# EAGLE design AgitPOV_WiFi (EAGLE 7.4.0)
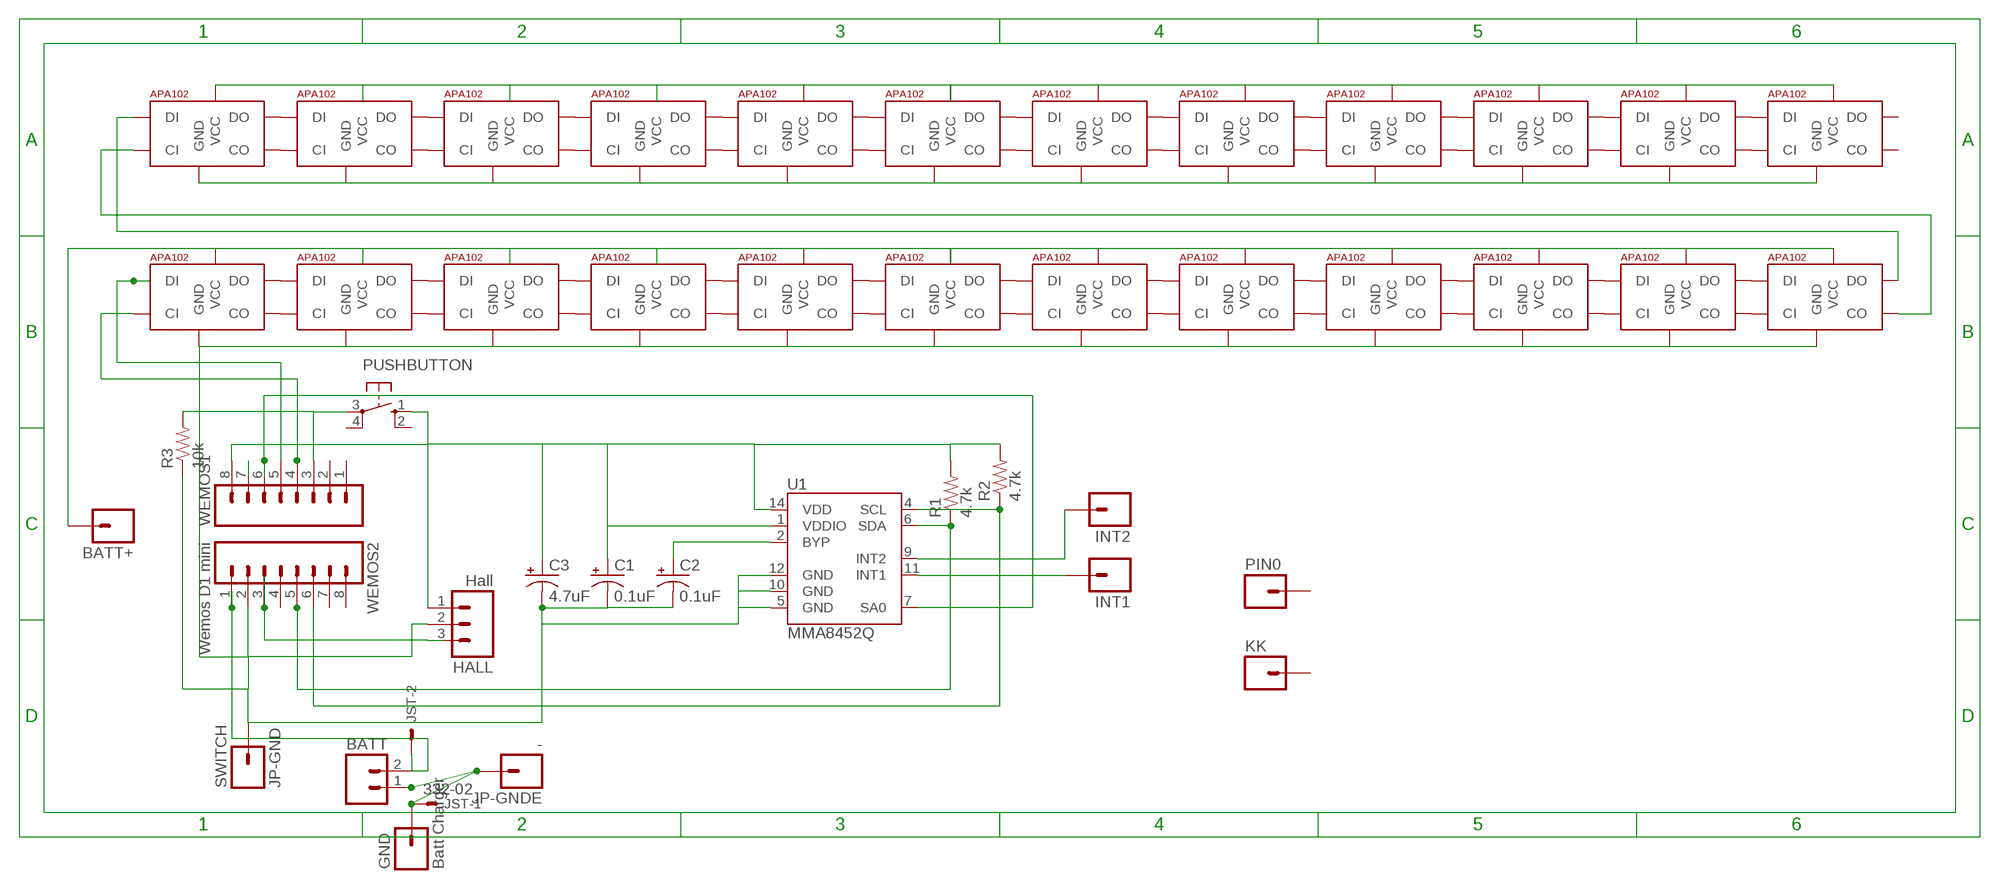
[diagram p0: schematic, sheet 1]

## Parts
BATT  M02LOCK_LONGPADS  [1X02_LOCK_LONGPADS]
BATT+  M01PTH  [1X01]
C1  0.1uF  10UF-16V-10%(TANT)  [EIA3216]
C2  0.1uF  10UF-16V-10%(TANT)  [EIA3216]
C3  4.7uF  10UF-16V-10%(TANT)  [EIA3216]
DEL1  APA1025050  [APA102_5050]
DEL2  APA1025050  [APA102_5050]
DEL3  APA1025050  [APA102_5050]
DEL4  APA1025050  [APA102_5050]
DEL5  APA1025050  [APA102_5050]
DEL6  APA1025050  [APA102_5050]
DEL7  APA1025050  [APA102_5050]
DEL8  APA1025050  [APA102_5050]
DEL9  APA1025050  [APA102_5050]
DEL10  APA1025050  [APA102_5050]
DEL11  APA1025050  [APA102_5050]
DEL12  APA1025050  [APA102_5050]
DEL13  APA1025050  [APA102_5050]
DEL15  APA1025050  [APA102_5050]
DEL16  APA1025050  [APA102_5050]
DEL17  APA1025050  [APA102_5050]
DEL18  APA1025050  [APA102_5050]
DEL19  APA1025050  [APA102_5050]
DEL20  APA1025050  [APA102_5050]
DEL21  APA1025050  [APA102_5050]
DEL22  APA1025050  [APA102_5050]
DEL23  APA1025050  [APA102_5050]
DEL24  APA1025050  [APA102_5050]
FFFFF  APA1025050  [APA102_5050]
GND  Batt Charger  M01PTH  [1X01]
HALL  Hall  M03PTH  [1X03]
INT1  M01PTH  [1X01]
INT2  M01PTH  [1X01]
JP-GND  SWITCH  M01PTH  [1X01]
JP-GNDE  -  M01PTH  [1X01]
JST  332-02  [332-02]
KK  M01PTH  [1X01]
PIN0  M01PTH  [1X01]
PUSHBUTTON  10-XX  [B3F-10XX]
R1  4.7k  RESISTOR1206  [1206]
R2  4.7k  RESISTOR1206  [1206]
R3  10k  RESISTOR1206  [1206]
U1  MMA8452Q  [QFN-16_0.5MM]
WEMOS1  M08  [1X08_ROUND]
WEMOS2  Wemos D1 mini  M08  [1X08_ROUND]

## Nets
5V: BATT+.1 BATT.2 DEL1.1(VCC) DEL2.1(VCC) DEL3.1(VCC) DEL4.1(VCC) DEL5.1(VCC) DEL6.1(VCC) DEL7.1(VCC) DEL8.1(VCC) DEL9.1(VCC) DEL10.1(VCC) DEL11.1(VCC) DEL12.1(VCC) DEL13.1(VCC) DEL15.1(VCC) DEL16.1(VCC) DEL17.1(VCC) DEL18.1(VCC) DEL19.1(VCC) DEL20.1(VCC) DEL21.1(VCC) DEL22.1(VCC) DEL23.1(VCC) DEL24.1(VCC) FFFFF.1(VCC) JST.2 WEMOS2.1
+3.3V: C1.A(+) C3.A(+) HALL.1 PUSHBUTTON.1(S) R1.2 R2.2 U1.1(VDDIO) U1.14(VDD) WEMOS1.8
BYP: C2.A(+) U1.2(BYP)
ENTREEGND: BATT.1 GND.1 JP-GNDE.1 JST.1
GND: C1.C(-) C2.C(-) C3.C(-) DEL1.6(GND) DEL2.6(GND) DEL3.6(GND) DEL4.6(GND) DEL5.6(GND) DEL6.6(GND) DEL7.6(GND) DEL8.6(GND) DEL9.6(GND) DEL10.6(GND) DEL11.6(GND) DEL12.6(GND) DEL13.6(GND) DEL15.6(GND) DEL16.6(GND) DEL17.6(GND) DEL18.6(GND) DEL19.6(GND) DEL20.6(GND) DEL21.6(GND) DEL22.6(GND) DEL23.6(GND) DEL24.6(GND) FFFFF.6(GND) HALL.2 JP-GND.1 R3.1 U1.5(GND) U1.10(GND) U1.12(GND) WEMOS2.2
N$1: WEMOS1.7
N$2: DEL1.5(CI) WEMOS1.4
N$4: DEL1.4(DI) WEMOS1.5
N$8: DEL12.2(CO) DEL13.5(CI)
N$12: DEL2.2(CO) DEL3.5(CI)
N$14: DEL2.3(DO) DEL3.4(DI)
N$15: DEL1.3(DO) DEL2.4(DI)
N$16: DEL1.2(CO) DEL2.5(CI)
N$17: DEL3.3(DO) DEL4.4(DI)
N$18: DEL3.2(CO) DEL4.5(CI)
N$19: DEL4.3(DO) DEL5.4(DI)
N$20: DEL4.2(CO) DEL5.5(CI)
N$21: DEL5.3(DO) DEL6.4(DI)
N$22: DEL5.2(CO) DEL6.5(CI)
N$23: DEL6.3(DO) DEL7.4(DI)
N$24: DEL6.2(CO) DEL7.5(CI)
N$25: DEL7.3(DO) DEL8.4(DI)
N$26: DEL7.2(CO) DEL8.5(CI)
N$27: DEL8.3(DO) DEL9.4(DI)
N$28: DEL8.2(CO) DEL9.5(CI)
N$29: DEL9.3(DO) DEL10.4(DI)
N$30: DEL9.2(CO) DEL10.5(CI)
N$31: DEL10.3(DO) DEL11.4(DI)
N$32: DEL10.2(CO) DEL11.5(CI)
N$33: DEL11.3(DO) DEL12.4(DI)
N$34: DEL11.2(CO) DEL12.5(CI)
N$41: HALL.3 WEMOS2.3
N$42: DEL12.3(DO) DEL13.4(DI)
N$43: DEL15.5(CI) FFFFF.2(CO)
N$44: DEL15.4(DI) FFFFF.3(DO)
N$45: DEL13.3(DO) FFFFF.4(DI)
N$46: DEL13.2(CO) FFFFF.5(CI)
N$47: DEL15.3(DO) DEL16.4(DI)
N$48: DEL15.2(CO) DEL16.5(CI)
N$49: DEL16.3(DO) DEL17.4(DI)
N$50: DEL16.2(CO) DEL17.5(CI)
N$51: DEL17.3(DO) DEL18.4(DI)
N$52: DEL17.2(CO) DEL18.5(CI)
N$53: DEL18.3(DO) DEL19.4(DI)
N$54: DEL18.2(CO) DEL19.5(CI)
N$55: DEL19.3(DO) DEL20.4(DI)
N$56: DEL19.2(CO) DEL20.5(CI)
N$57: DEL20.3(DO) DEL21.4(DI)
N$58: DEL20.2(CO) DEL21.5(CI)
N$59: DEL21.3(DO) DEL22.4(DI)
N$60: DEL21.2(CO) DEL22.5(CI)
N$61: DEL22.3(DO) DEL23.4(DI)
N$62: DEL22.2(CO) DEL23.5(CI)
N$63: DEL23.3(DO) DEL24.4(DI)
N$64: DEL23.2(CO) DEL24.5(CI)
N$65: INT1.1 U1.11(INT1)
N$67: INT2.1 U1.9(INT2)
PULLDOWN: PUSHBUTTON.3(P) R3.2 WEMOS1.3
SA0: U1.7(SA0) WEMOS1.6
SCL: R2.1 U1.4(SCL) WEMOS2.6
SDA: R1.1 U1.6(SDA) WEMOS2.5
Unconnected: DEL24.2(CO) DEL24.3(DO) KK.1 PIN0.1 PUSHBUTTON.2(S1) PUSHBUTTON.4(P1) WEMOS1.1 WEMOS1.2 WEMOS2.4 WEMOS2.7 WEMOS2.8

## Library data of the parts
BATT = SparkFun-Connectors:M02: Standard 2-pin 0.1" header. Use with - straight break away headers ( PRT-00116) - right angle break away headers (PRT-00553) - swiss pins (PRT-00743) - machine pins (PRT-00117) - female headers (PRT-00115) Molex polarized connector foot print use with: PRT-08233 with associated crimp pins and housings. 2.54_SCREWTERM for use with PRT-10571. 3.5mm Screw Terminal footprints for PRT-08084 5mm Screw Terminal footprints for use with PRT-08432
BATT+ GND INT1 INT2 JP-GND JP-GNDE KK PIN0 = SparkFun-Connectors:M01: Header 1 Standard 1-pin 0.1" header. Use with straight break away headers (SKU : PRT-00116), right angle break away headers (PRT-00553), swiss pins (PRT-00743), machine pins (PRT-00117), and female headers (PRT-00115).
C1-C3 = SparkFun-Capacitors:10UF-16V-10%(TANT): CAP-00811 1206/EIA-3216 Tantalum capacitor; PROD_ID: CAP-00811; VALUE: 10uF
DEL1-DEL13 DEL15-DEL24 FFFFF = jos-ph:APA102: APA102C 5050 RGB LED -- Adafruit DotStar Single LED Pixel Product Page: https://www.adafruit.com/products/2343 Datasheet: https://cdn-shop.adafruit.com/product-files/2343/APA102C.pdf
HALL = SparkFun-Connectors:M03: Header 3 Standard 3-pin 0.1" header. Use with straight break away headers (SKU : PRT-00116), right angle break away headers (PRT-00553), swiss pins (PRT-00743), machine pins (PRT-00117), and female headers (PRT-00115). Molex polarized connector foot print use with SKU : PRT-08232 with associated crimp pins and housings.
JST = con-garry:332-02: 2 Pin - 2mm Dual Row Source: www.mpe-connector.de / garry_shortform_2012.pdf
PUSHBUTTON = switch-omron:10-XX: OMRON SWITCH; MPN: B3F-1000; OC_FARNELL: 176432; OC_NEWARK: 36M3542
R1-R3 = SparkFun-Resistors:RESISTOR: Resistor Basic schematic elements and footprints for 0603, 1206, and PTH resistors.
U1 = SparkFun-Sensors:MMA8452Q: MMA8452Q 3-Axis, 12/8-bit Digital Accelerometer Supply Voltage: 1.6-3.6V Range: +/- 2g, 4g, 8g Interface: I2C, 12-bit and 8-bit ODR: 1.56 Hz - 800 Hz Package: QFN-16 http://cache.freescale.com/files/sensors/doc/data_sheet/MMA8452Q.pdf; PROD_ID: IC-10769
WEMOS1 WEMOS2 = SparkFun-Connectors:M08: Header 8 Standard 8-pin 0.1" header. Use with straight break away headers (SKU : PRT-00116), right angle break away headers (PRT-00553), swiss pins (PRT-00743), machine pins (PRT-00117), and female headers (PRT-00115).

## Board
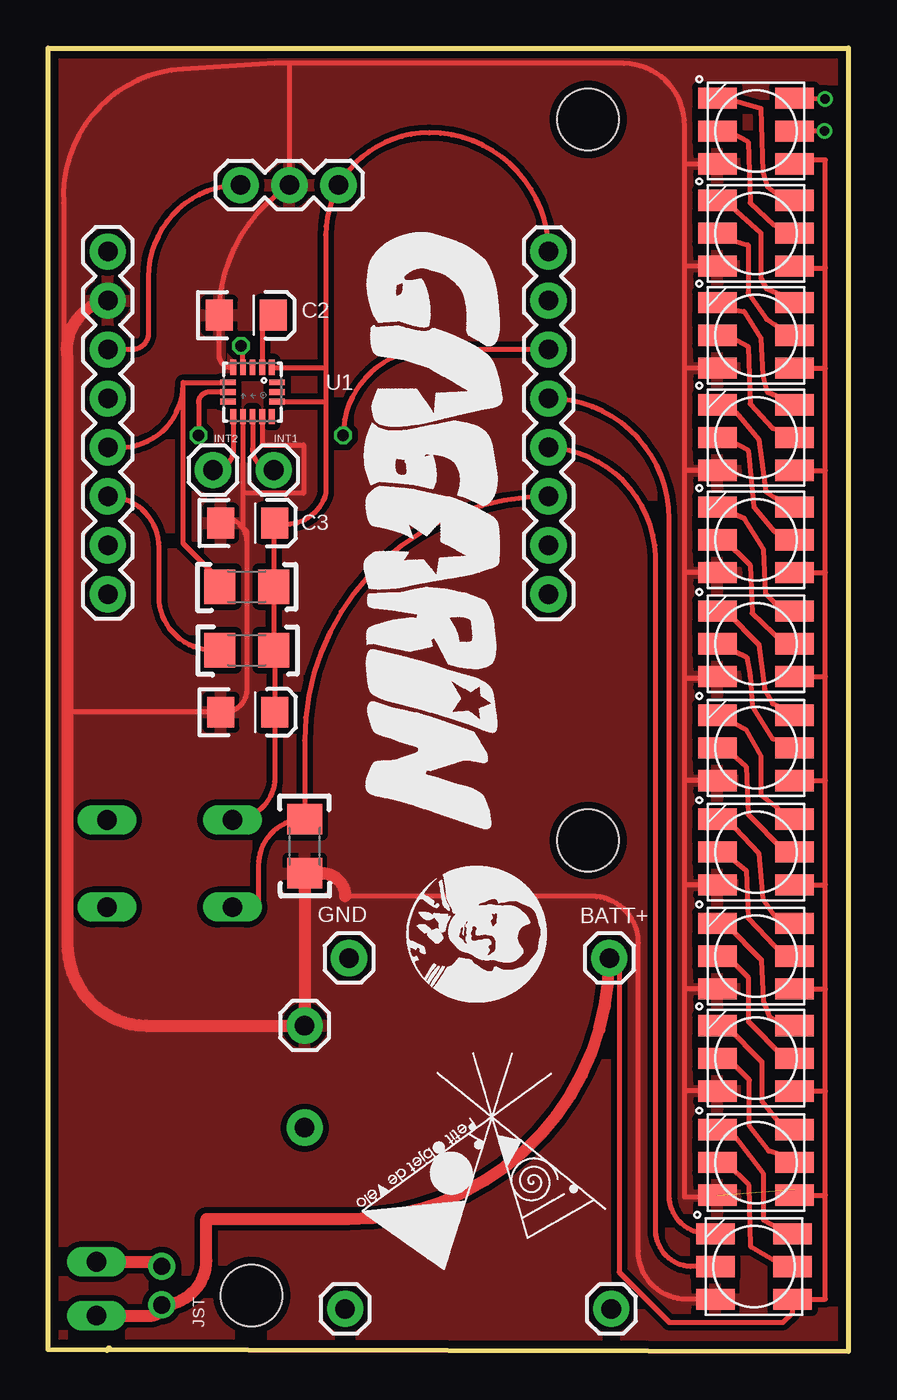
[diagram p1: board, top side]
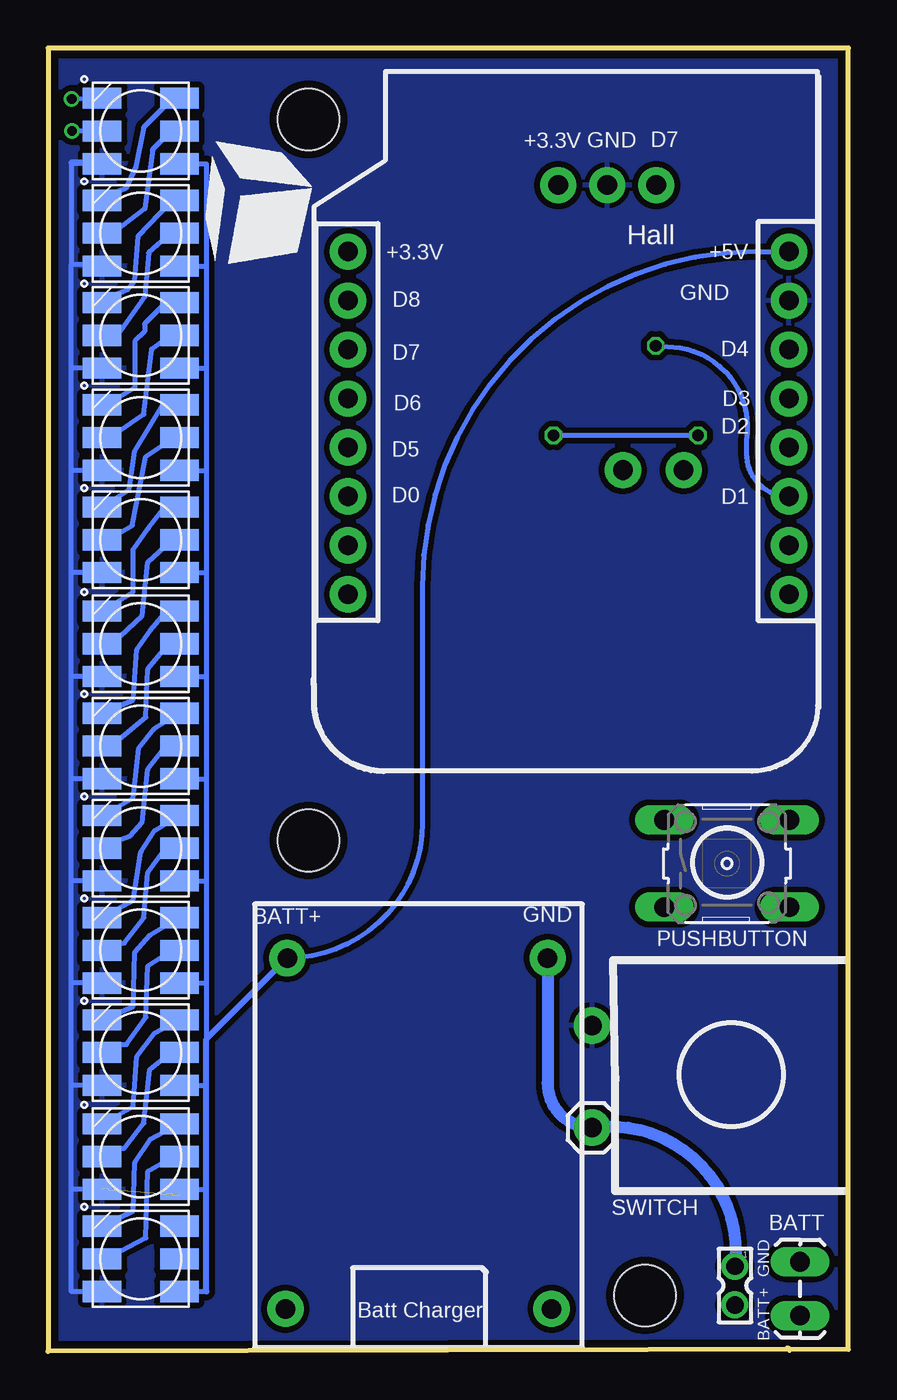
[diagram p2: board, bottom side, seen from below]

Size 41.5 x 67.6 mm. Coordinates in mm from the lower left corner, seen from the top.
Outline: 3.05,0.03 arc-90 3.19,0.17
Outline: 0,0.1 0,67.6 41.5,67.6 41.5,0 0,0.1
Copper layers (1*16): Top 0.035mm / dielectric 1.5mm / Bottom 0.035mm
Design rules "NOA Eagle Rule 2016-06-12": minimum track width 6mil, minimum drill 0.3mm, track to track 6mil, track to pad 6mil, pad to pad 6mil, via to via 6mil, smd to smd 0mil, copper to edge 0.4mm, drill to drill 10mil, minimum pad ring 10mil, minimum via ring 6mil, stop-mask expansion 2mil, vias tented up to drill 25mil, thermal gap 10mil
Holes 3.2 mm at 28,26.5 28,63.9 10.55,2.9

### Footprints (pad centres in the part's own frame; a part is rotated, then mirrored left to right if it is on the bottom)
1X02_LOCK_LONGPADS = drill 1.016 long: 1 -0.127,0; 2 2.667,0
1X01 = drill 1.016 pad 1.88: 1 0,0
EIA3216 = smd 1.4 x 1.6: A 1.4,0; C -1.4,0
APA102_5050 = smd 2 x 1.1: 1 2,-1.7; 2 2,0; 3 2,1.7; 4 -2,1.7; 5 -2,0; 6 -2,-1.7
1X03 = drill 1.016 pad 1.88: 1 0,0; 2 2.54,0; 3 5.08,0
332-02 = drill 0.9 pad 1.27: 1 0,-1; 2 0,1
B3F-10XX = drill 1.016 long: 1 -3.251,2.261; 2 3.251,2.261; 3 -3.251,-2.261; 4 3.251,-2.261
1206 = smd 1.6 x 1.8: 1 -1.4,0; 2 1.4,0
QFN-16_0.5MM = smd 0.8 x 0.3: 1 -1.275,1; 2 -1.275,0.5; 3 -1.275,0; 4 -1.275,-0.5; 5 -1.275,-1; 9 1.275,-1; 10 1.275,-0.5; 11 1.275,0; 12 1.275,0.5; 13 1.275,1 | smd 0.3 x 0.8: 6 -0.5,-1.275; 7 0,-1.275; 8 0.5,-1.275; 14 0.5,1.275; 15 0,1.275; 16 -0.5,1.275
1X08_ROUND = drill 1.016 pad 1.88: 1 0,0; 2 2.54,0; 3 5.08,0; 4 7.62,0; 5 10.16,0; 6 12.7,0; 7 15.24,0; 8 17.78,0

### Placement (x,y rotation side)
BATT  2.51,4.52 270 bottom
BATT+  29.1,20.4 0 top
C1  10.35,33.15 0 top
C2  10.27,53.75 0 top
C3  10.35,42.96 0 top
DEL1  36.6,4.4 0 top
DEL2  36.7,9.8 0 top
DEL3  36.7,15.2 0 top
DEL4  36.7,20.5 0 top
DEL5  36.7,25.9 0 top
DEL6  36.7,31.3 0 top
DEL7  36.7,36.7 0 top
DEL8  36.7,42.1 0 top
DEL9  36.7,47.4 0 top
DEL10  36.7,52.7 0 top
DEL11  36.7,58 0 top
DEL12  36.7,63.3 0 top
DEL13  36.7,63.3 0 bottom
DEL15  36.7,52.7 0 bottom
DEL16  36.7,47.4 0 bottom
DEL17  36.7,42.1 0 bottom
DEL18  36.7,36.7 0 bottom
DEL19  36.7,31.4 0 bottom
DEL20  36.7,26.1 0 bottom
DEL21  36.7,20.8 0 bottom
DEL22  36.7,15.5 0 bottom
DEL23  36.7,10.1 0 bottom
DEL24  36.7,4.8 0 bottom
FFFFF  36.7,58 0 bottom
GND  15.6,20.4 0 top
HALL  15.05,60.5 180 top
INT1  11.7,45.71 0 top
INT2  8.55,45.71 0 top
JP-GND  13.3,16.9 90 top
JP-GNDE  13.3,11.6 90 bottom
JST  5.89,3.41 180 bottom
KK  15.4,2.2 0 top
PIN0  29.2,2.2 0 top
PUSHBUTTON  6.3,25.31 0 bottom
R1  10.3,39.67 0 top
R2  10.3,36.37 0 top
R3  13.3,26.2 90 top
U1  10.6,49.76 270 top
WEMOS1  25.95,39.27 90 top
WEMOS2  3.09,57.05 270 top

### Tracks (layer width: path | path; a pad name or v marks a point on that pad's centre or on a via)
5V
  Top 0.254: 40.3,8.1 40.3,2.7 DEL1.1 38.6,2 38.1,1.5 32.2,1.5 29.6,4.1 29.6,19.9 arc90 BATT+.1 | 40.3,8.1 40.3,13.5 | 40.3,13.5 40.3,18.8 | 40.3,18.8 40.3,24.2 | 40.3,24.2 40.3,29.6 | 40.3,29.6 40.3,35 | 40.3,35 40.3,40.4 | 40.3,40.4 40.3,45.7 | 40.3,45.7 40.3,51 | 40.3,51 40.3,56.2 | 40.3,56.2 40.3,61.8 38.7,61.8 DEL12.1 | DEL11.1 39.2,56.3 39.2,56.2 40.3,56.2 | DEL2.1 40.3,8.1 | DEL3.1 40.3,13.5 | DEL4.1 40.3,18.8 | DEL5.1 40.3,24.2 | DEL6.1 40.3,29.6 | DEL7.1 40.3,35 | DEL8.1 40.3,40.4 | DEL9.1 40.3,45.7 | DEL10.1 40.3,51
  Top 0.61: BATT.2 5.33,1.85 arc90 JST.2 arc90 8.2,4.72 8.2,6.86 15.56,6.86 arc90 BATT+.1
  Bottom 0.254: BATT+.1 arc-90 22.1,27.4 22.1,39.7 arc90 4.75,57.05 WEMOS2.1 | DEL13.1 33.3,61.6 33.3,56.3 | 33.3,56.3 33.3,51 | 33.3,51 33.3,45.7 | 33.3,45.7 33.3,40.4 | 33.3,40.4 33.3,35 | 33.3,35 33.3,29.7 | 33.3,29.7 33.3,24.4 | 33.3,24.4 33.3,19.1 | 33.3,19.1 33.3,13.8 | 33.3,13.8 33.3,8.4 | 33.3,8.4 33.3,3.1 DEL24.1 | FFFFF.1 33.3,56.3 | DEL15.1 33.3,51 | DEL16.1 33.3,45.7 | DEL17.1 33.3,40.4 | DEL18.1 33.3,35 | DEL19.1 33.3,29.7 | DEL20.1 33.3,24.4 | DEL21.1 33.3,19.1 | DEL22.1 33.3,13.8 | DEL23.1 33.3,8.4
  Bottom 0.305: WEMOS2.1 3.09,57.03 | 33.3,3.1 33.3,16.2 BATT+.1
+3.3V
  Top 0.254: PUSHBUTTON.1 arc90 11.75,29.76 C1.A 11.75,36.32 R2.2 R1.2 11.7,42.92 C3.A arc90 14.4,44.51 14.4,49.16 | WEMOS1.8 arc90 19.78,63.21 19.75,63.21 arc60 HALL.1 arc31 14.4,57.46 14.4,51.01 | 14.4,51.01 14.4,49.16 | U1.14 14.3,49.26 arc-90 14.4,49.16 | U1.1 14.37,51.04 arc-90 14.4,51.01
BYP
  Top 0.254: C2.A 11.1,53.17 U1.2
ENTREEGND
  Top 0.61: BATT.1 5.65,4.65 arc-90 JST.1
  Bottom 0.61: GND.1 15.6,13.9 arc-90 JP-GNDE.1 arc105 JST.1
GND  (1 unrouted)
  Top 0.254: DEL2.6 34.7,8 33,8 33,13.5 | 33,13.5 33,18.8 | 33,18.8 33,24.2 | 33,24.2 33,29.6 | 33,29.6 33,34.9 | 33,34.9 33,40.4 | 33,40.4 33,45.7 | 33,45.7 33,51 | 33,51 33,56.3 | 33,56.3 33,61.5 | DEL11.6 33,56.3 | DEL10.6 33,51 | DEL9.6 33,45.7 | DEL8.6 33,40.4 | DEL6.6 33,29.6 | DEL5.6 33,24.2 | DEL4.6 33,18.8 | DEL3.6 33,13.5 | DEL7.6 34.6,35 arc-90 34.5,34.9 33,34.9 | 33,61.5 arc-90 33.1,61.6 DEL12.6 | DEL1.6 33.1,2.7 arc-90 30.6,5.2 30.6,21.2 arc90 28.2,23.6 19.5,23.6 | 19.5,23.6 15.4,23.6 | 19.4,23.7 arc90 19.5,23.6 | 12.6,66.81 29.85,66.81 arc-90 33,63.56 33,61.5 | 12.6,66.81 11.75,66.81 7,66.51 arc90 0.8,59.56 0.8,51.72 arc90 1,51.52 | 1,33.16 C1.C 9.13,33.15 arc90 10.3,34.31 10.3,41.96 | C3.C 8.95,43.31 arc-90 10.3,41.96 | U1.5 arc-90 8.87,51.56 C2.C arc-57 HALL.2 12.51,66.73 arc-90 12.6,66.81 | 10.1,47.11 U1.10 10.1,44.51 | 10.1,44.51 10.1,42.66 arc-90 10.3,42.46 10.3,41.96 | U1.12 11.1,47.01 13.25,47.01 13.25,44.51 10.1,44.51
  Top 0.61: 15.4,23.6 arc90 14.2,24.8 R3.1 JP-GND.1 arc-90 13.28,16.88 5.08,16.88 arc-90 1,21.16 1,33.16 1,51.52 arc-90 WEMOS2.2
  Bottom 0.254: DEL24.6 40.3,3.1 40.3,8.4 | 40.3,8.4 40.3,13.8 | 40.3,13.8 40.3,19.1 | 40.3,19.1 40.3,24.4 | 40.3,24.4 40.3,29.7 | 40.3,29.7 40.3,35 | 40.3,35 40.3,40.4 | 40.3,40.4 40.3,45.7 | 40.3,45.7 40.3,51 | 40.3,51 40.3,56.4 | 40.3,61.6 40.3,61.7 39.3,61.7 39.3,61.6 | DEL13.6 40.3,61.6 | 40.3,61.6 40.3,56.4 | 40.3,56.4 39.4,56.4 | 39.4,56.4 39.4,56.3 39.3,56.3 39.3,56.1 | DEL15.6 40.3,51 | DEL16.6 40.3,45.7 | DEL17.6 40.3,40.4 | DEL18.6 40.3,35 | DEL19.6 40.3,29.7 | DEL20.6 40.3,24.4 | DEL21.6 40.3,19.1 | DEL22.6 40.3,13.8 | DEL23.6 40.3,8.4 | FFFFF.6 38.83,56.41 39.29,56.41 39.4,56.4
  pour Top (isolate 0.305): 0,67.4 41.3,67.5 41.1,0 0.3,0.2 0,65.5
  pour Bottom (isolate 0.305): -0.1,67.6 41.45,67.6 41.45,58.55 41.5,0.05 0.2,0.1 -0.2,65.4
N$2
  Top 0.254: DEL1.5 33.3,4.4 arc-90 31.5,6.4 31.5,40.74 arc90 WEMOS1.4
N$4
  Top 0.254: DEL1.4 34.2,6.1 arc-90 32.2,8.1 32.2,43.18 arc90 WEMOS1.5
N$8  (via drill 0.5 pad 0.25)
  Top 0.254: v40.26,63.3 DEL12.2
  Bottom 0.254: DEL12.2 v40.26,63.3
N$12
  Top 0.254: DEL3.5 34.73,15.02 35.41,15.02 36.35,14.08 36.35,11.69 37.36,10.39 38.61,9.99 DEL2.2
N$14
  Top 0.254: DEL2.3 38.61,11.59 38.5,11.51 38.17,11.51 37.01,12.97 37.01,15.02 35.18,16.85 34.73,16.85 DEL3.4
N$15
  Top 0.254: DEL1.3 38.4,6.1 37.1,6.8 37.1,9.2 35.5,11.3 34.9,11.3 DEL2.4
N$16
  Top 0.254: DEL2.5 34.73,9.76 35.18,9.76 36.34,8.61 36.44,5.42 38.38,4.28 DEL1.2
N$17
  Top 0.254: DEL3.3 38.61,17.08 38.23,16.87 37.4,17.37 37.08,18.18 36.98,20.31 35.18,22.11 34.73,22.11 DEL4.4
N$18
  Top 0.254: DEL4.5 34.73,20.28 35.41,20.28 36.33,19.37 36.33,17.08 38.16,15.25 DEL3.2
  Top 0.305: DEL3.2 38.2,15.2
N$19
  Top 0.254: DEL4.3 38.61,22.34 38.2,22.05 37.97,22.15 37.05,23.47 36.85,25.82 35.18,27.6 34.73,27.6 DEL5.4
N$20
  Top 0.254: DEL4.2 38.61,20.51 38.16,20.51 36.3,22.47 36.2,24.95 35.18,25.77 34.73,25.77 DEL5.5
N$21
  Top 0.254: DEL5.3 38.61,27.82 37.93,27.81 37.8,28.21 36.95,28.85 36.95,30.88 36.18,32.25 35.63,32.55 DEL6.4
N$22
  Top 0.254: DEL5.2 38.61,26 38.16,26 36.3,27.85 36.2,30.34 35.18,31.25 34.73,31.25 DEL6.5
N$23
  Top 0.254: DEL6.3 38.61,33.08 38.2,33.3 37.57,33.6 37.15,34.31 36.85,36.67 35.18,38.34 34.73,38.34 DEL7.4
N$24
  Top 0.254: DEL6.2 38.61,31.48 37.56,31.78 36.5,33.44 36.4,35.03 36.21,36.01 35.63,36.31 DEL7.5
N$25
  Top 0.254: DEL7.3 38.1,38.4 37.2,39.3 37.1,41.6 36.1,43.2 DEL8.4
N$26
  Top 0.254: DEL7.2 38.61,36.74 38.16,36.74 36.5,38.3 36.4,40.78 34.98,42.2 34.53,42.2 DEL8.5
N$27
  Top 0.254: DEL8.3 38.41,44.03 37.63,44.31 37.2,44.61 37.05,45.75 36.85,47.28 35.78,48.56 35.73,48.66 DEL9.4
N$28
  Top 0.254: DEL8.2 38.41,42.43 37.66,42.53 36.6,43.78 36.3,46.74 34.98,47.46 34.53,47.46 DEL9.5
N$29
  Top 0.254: DEL9.3 38.41,49.28 38.2,49.4 37.27,49.8 37.05,50.61 36.95,52.57 36.08,53.94 35.53,54.04 DEL10.4
N$30
  Top 0.254: DEL9.2 38.41,47.68 37.56,47.88 36.4,49.14 36.3,52.13 35.21,52.71 34.53,52.71 DEL10.5
N$31
  Top 0.254: DEL10.3 38.41,54.77 38.13,54.76 37.2,55.16 36.95,55.7 36.95,58.03 34.98,59.8 34.53,59.8 DEL11.4
N$32
  Top 0.254: DEL10.2 37.71,53.24 37.26,53.54 36.3,54.9 36.3,57.38 35.28,57.7 34.53,58.2 DEL11.5
N$33
  Top 0.254: DEL11.3 38.41,60.03 37.93,59.91 37.3,60.41 37.05,61.16 36.95,64.49 34.98,65.06 34.53,65.06 DEL12.4
N$34
  Top 0.254: DEL11.2 38.41,58.43 37.66,58.43 36.4,59.59 36.3,62.74 34.98,63.46 34.53,63.46 DEL12.5
N$41
  Top 0.254: HALL.3 arc90 5.2,55.73 5.2,52.81 arc-90 4.35,51.97 WEMOS2.3
N$42  (via drill 0.5 pad 0.25)
  Top 0.254: DEL12.3 v40.28,64.98
  Bottom 0.254: v40.28,64.98 DEL12.3
N$43
  Bottom 0.254: DEL15.5 37.8,52.85 37.75,52.95 36.49,54.71 36.29,56.99 35.4,57.78 34.72,57.78 FFFFF.2
N$44
  Bottom 0.254: DEL15.4 38.6,54.58 37.62,54.96 37.39,55.06 37.05,55.51 36.85,57.84 35.18,59.61 34.72,59.61 FFFFF.3
N$45
  Bottom 0.254: FFFFF.4 38.6,59.84 37.72,60.22 37.49,60.32 36.95,61.47 36.55,63.49 35.18,64.87 34.72,64.87 DEL13.3
N$46
  Bottom 0.254: FFFFF.5 38.6,58.01 38.15,58.01 36.49,59.27 36.09,62.35 35.18,63.27 34.72,63.27 DEL13.2
N$47
  Bottom 0.254: DEL15.3 35.4,54.4 36.5,53.3 36.5,52.9 37,52.4 37,50 38.56,49.02 | 38.56,49.02 38.6,49 | DEL16.4 38.6,49.09 38.56,49.02
N$48
  Bottom 0.254: DEL15.2 34.72,52.52 35.4,52.52 36.13,51.99 36.53,48.61 38.15,47.49 38.6,47.49 DEL16.5
N$49
  Bottom 0.254: DEL17.4 37.3,44.7 37,46.7 35.5,49.2 35.44,49.08 | 35.44,49.08 35.3,48.8 | DEL16.3 34.72,49.09 35.4,49.09 35.44,49.08
N$50
  Bottom 0.254: DEL16.2 34.72,47.26 35.18,47.26 36.43,46.41 37.13,42.85 38.15,42.23 38.6,42.23 DEL17.5
N$51
  Bottom 0.254: DEL18.4 37.1,39.4 37.1,41.6 36.3,42.7 35.3,44 DEL17.3
N$52
  Bottom 0.254: DEL17.2 34.72,42.01 35.18,42.01 36.33,40.95 36.63,38.16 38.15,36.75 38.6,36.75 DEL18.5
N$53
  Bottom 0.254: DEL19.4 37.1,33.8 36.9,36.4 36.2,37.4 35.6,38.1 DEL18.3
N$54
  Bottom 0.254: DEL18.2 34.72,36.52 35.4,36.52 36.33,35.39 36.43,32.9 38.15,31.49 38.6,31.49 DEL19.5
N$55
  Bottom 0.254: DEL20.4 37.1,28.7 36.8,31.3 36,32.3 DEL19.3
N$56
  Bottom 0.254: DEL19.2 34.72,31.26 35.58,31.16 36.33,30.2 36.63,27.45 37.25,26.73 38.6,26.23 DEL20.5
N$57
  Bottom 0.254: DEL21.4 37.1,23.4 36.7,25.9 36,27 DEL20.3
N$58
  Bottom 0.254: DEL20.2 34.72,26 35.48,26 36.33,24.85 36.53,22.49 37.55,21.17 38.6,20.97 DEL21.5
N$59
  Bottom 0.254: DEL22.4 37.1,17.9 37,20.7 36.2,21.6 DEL21.3
N$60
  Bottom 0.254: DEL21.2 34.72,20.75 35.18,20.75 36.33,19.99 36.43,17.33 37.45,15.92 37.9,15.92 DEL22.5
N$61
  Bottom 0.254: DEL23.4 37.1,12.7 36.9,15.3 36,16.5 DEL22.3
N$62
  Bottom 0.254: DEL22.2 34.72,15.49 35.18,15.49 36.23,14.63 36.53,11.84 37.55,10.53 38,10.53 DEL23.5
N$63
  Bottom 0.254: DEL24.4 37.1,7.3 37,9.8 36.2,11 DEL23.3
N$64
  Bottom 0.254: DEL23.2 34.72,10 35.18,10 36.33,9.34 36.43,5.89 38.15,4.97 38.6,4.97 DEL24.5
N$65
  Top 0.254: U1.11 10.6,46.81 arc90 INT1.1
N$67
  Top 0.254: U1.9 9.6,46.76 arc-90 INT2.1
PULLDOWN
  Top 0.254: WEMOS1.3 arc90 13.3,31.7 R3.2 arc90 10.9,25.2 10.9,23.08 arc-90 10.86,23.05 PUSHBUTTON.3
SA0  (via drill 0.6)
  Top 0.254: U1.7 8.35,49.76 arc90 7.8,49.21 v7.8,47.51 | WEMOS1.6 19.75,51.97 arc90 v15.3,47.51
  Bottom 0.254: v7.8,47.51 v15.3,47.51
SCL  (via drill 0.6)
  Top 0.254: R2.1 8.54,36.37 arc-90 5.75,39.16 5.75,41.69 arc90 WEMOS2.6 | U1.4 10.1,52.06 arc90 v10,52.16
  Bottom 0.254: v10,52.16 8.75,52.06 arc90 5.3,47.26 5.3,46.55 arc-90 WEMOS2.6
SDA
  Top 0.254: R1.1 8.9,40.01 7,41.91 7,50.16 | 7,50.16 7,50.26 U1.6 | WEMOS2.5 3.72,46.89 arc90 7,50.16

### Text on the board
bNames: D7 | GND | +3.3V | +5V | +3.3V | GND | D8 | D4 | D7 | D3 | D6 | D2 | D5 | D1 | D0 | GND | BATT+ | GND | BATT+
tValues: R3 | R2 | C1 | R1
uqam: v0.2
noms_b: V+ | 3V3 | G | D4 | D7 | D2 | A0
192bmp: /Users/uqam/Desktop/ohanda_logo.bmp
noms_t: G | DHT11 | D7 | SPKR | 3V | A0 | D2 | G | DEL | V+ | D2 | A0 | D4 | D7 | G | G | V+ | 3V3 | V+ | MQ-7 | V+ | PWR | G
225bmp: /Users/uqam/Documents/AgitPOV_WiFi/logo_texte_gagarin.bmp